# EAGLE design Felderblock6-a-2 (EAGLE 9.6.2)
AUTHOR: Balazs Racz; DRAWING_TITLE: Felderblock Mockup; LICENSE: Licensed by the Solderpad Hardware License V2.0; REVISION: A1; YEAR: 2024
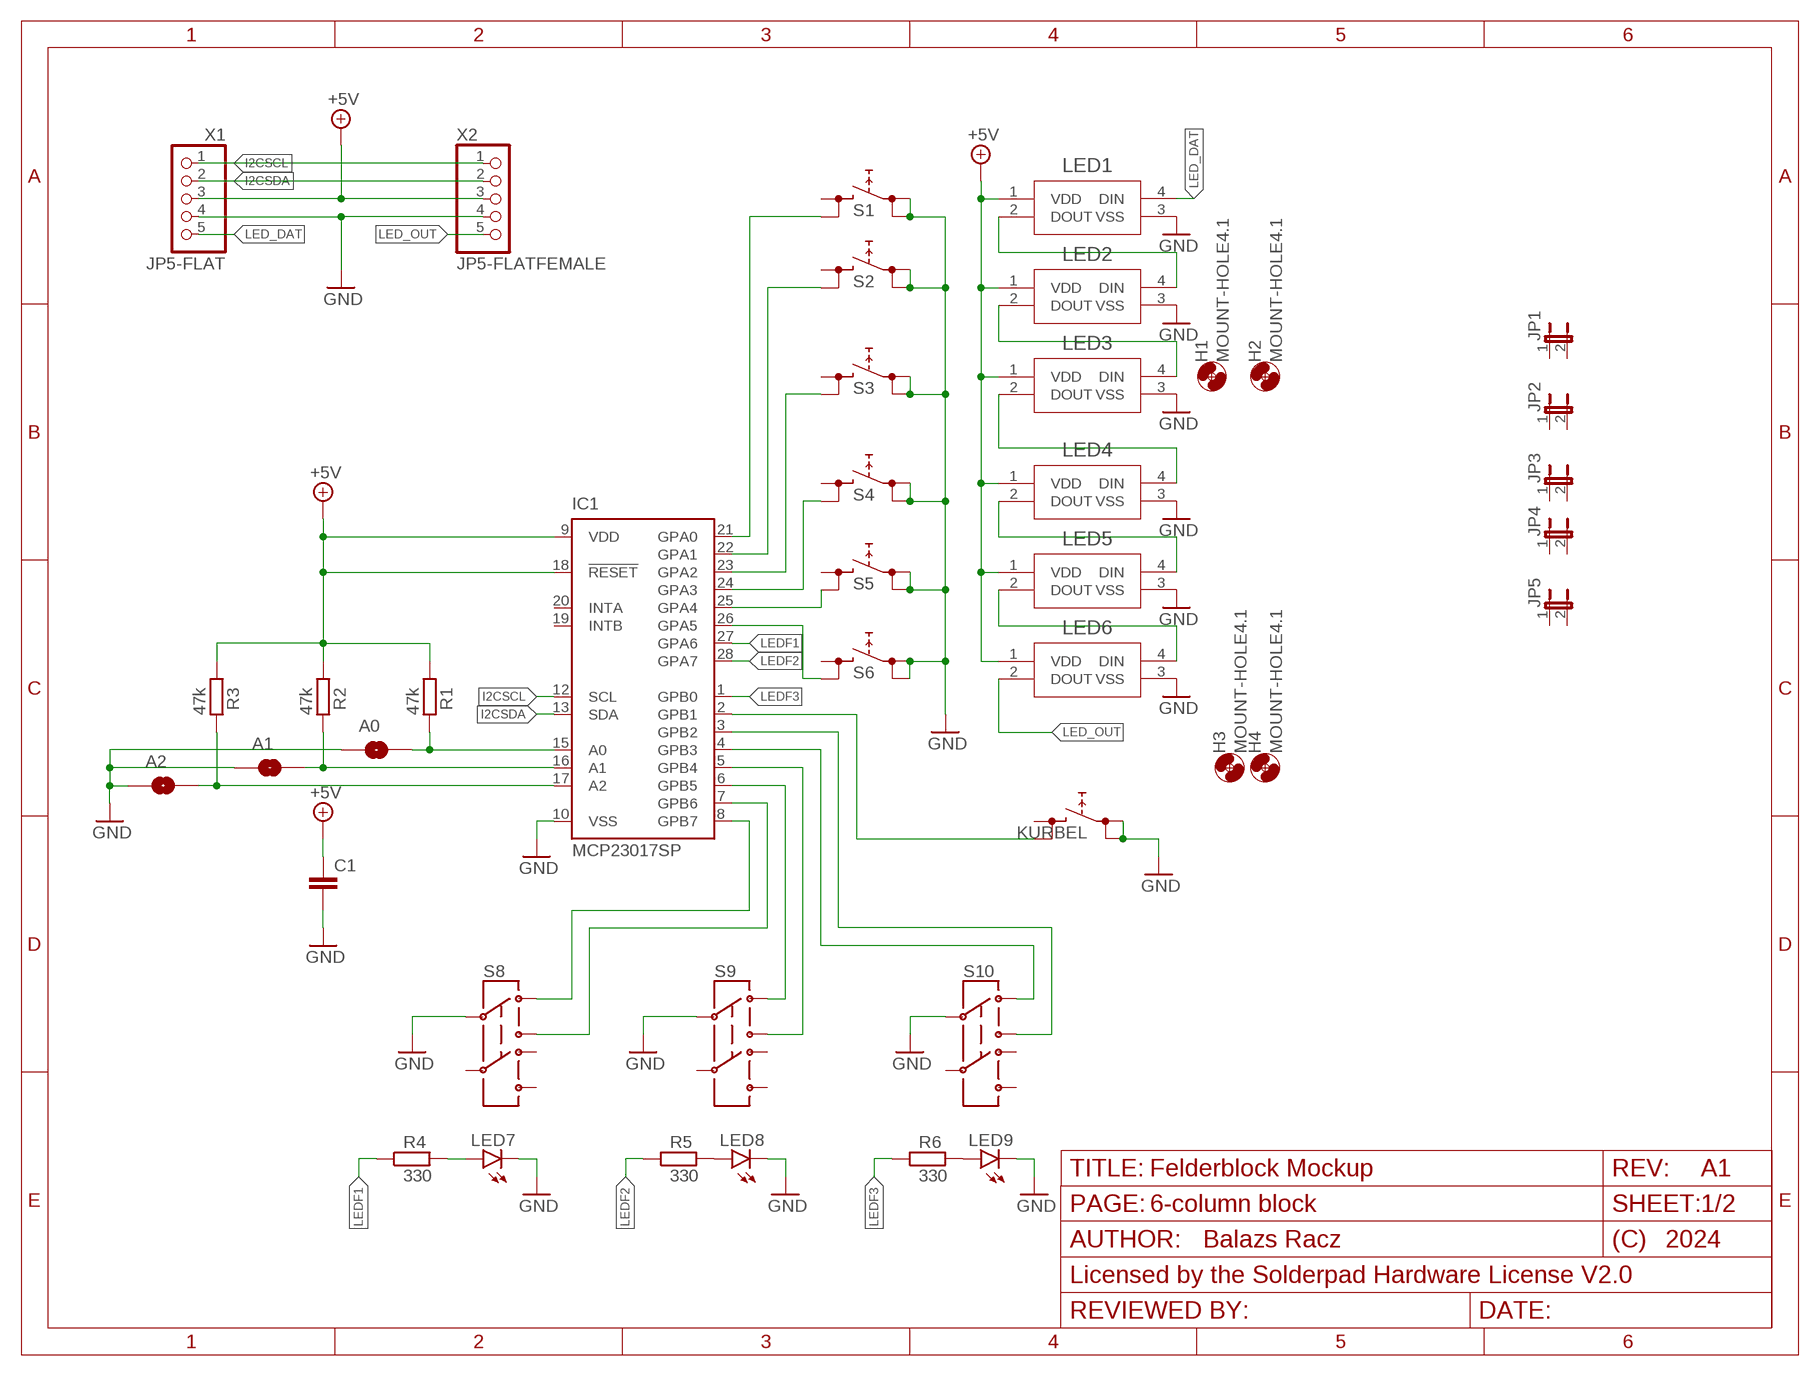
[diagram p0: schematic, sheet 1]
FRAME1 (FRAME_A_L): PAGE: 6-column block
FRAME2 (FRAME_A_L): PAGE: Input ports

## Parts
A0  SJRND2  [SJ_RND2]
A1  SJRND2  [SJ_RND2]
A2  SJRND2  [SJ_RND2]
C1  C-EUC0805  [C0805]
H1  MOUNT-HOLE4.1  [4,1]
H2  MOUNT-HOLE4.1  [4,1]
H3  MOUNT-HOLE4.1  [4,1]
H4  MOUNT-HOLE4.1  [4,1]
IC1  MCP23017SP  [DIL28-3]
JP1  FELD-BOARD-HOLDER  [FELD-BOARD-HOLDER]
JP2  FELD-BOARD-HOLDER  [FELD-BOARD-HOLDER]
JP3  FELD-BOARD-HOLDER  [FELD-BOARD-HOLDER]
JP4  FELD-BOARD-HOLDER  [FELD-BOARD-HOLDER]
JP5  FELD-BOARD-HOLDER  [FELD-BOARD-HOLDER]
KURBEL  W1  TACTSW-6X6S  [TACTSW-6X6]
LED1  LED-2812BCOM-16347_SPK-M  [COM-16347_SPK-M]
LED2  LED-2812BCOM-16347_SPK-M  [COM-16347_SPK-M]
LED3  LED-2812BCOM-16347_SPK-M  [COM-16347_SPK-M]
LED4  LED-2812BCOM-16347_SPK-M  [COM-16347_SPK-M]
LED5  LED-2812BCOM-16347_SPK-M  [COM-16347_SPK-M]
LED6  LED-2812BCOM-16347_SPK-M  [COM-16347_SPK-M]
LED7  LEDCHIPLED_0805  [CHIPLED_0805]
LED8  LEDCHIPLED_0805  [CHIPLED_0805]
LED9  LEDCHIPLED_0805  [CHIPLED_0805]
R1  47k  R-EU_R0805  [R0805]
R2  47k  R-EU_R0805  [R0805]
R3  47k  R-EU_R0805  [R0805]
R4  330  R-EU_R0805  [R0805]
R5  330  R-EU_R0805  [R0805]
R6  330  R-EU_R0805  [R0805]
S1  W1  TACTSW-6X6S  [TACTSW-6X6]
S2  W1  TACTSW-6X6S  [TACTSW-6X6]
S3  W1  TACTSW-6X6S  [TACTSW-6X6]
S4  W1  TACTSW-6X6S  [TACTSW-6X6]
S5  W1  TACTSW-6X6S  [TACTSW-6X6]
S6  W1  TACTSW-6X6S  [TACTSW-6X6]
S8  SWITCH-DPDT  [DP-T1]
S9  SWITCH-DPDT  [DP-T1]
S10  SWITCH-DPDT  [DP-T1]
X1  JP5-FLAT  [JP5F]
X2  JP5-FLATFEMALE  [JP5F-FEM]

## Nets
+5V [pwr]: C1.1 IC1.9(VDD) IC1.18(!RESET) LED1.1(VDD) LED2.1(VDD) LED3.1(VDD) LED4.1(VDD) LED5.1(VDD) LED6.1(VDD) R1.1 R2.1 R3.1 X1.3 X2.3
GND: A0.P$1 A1.P$1 A2.P$1 C1.2 IC1.10(VSS) KURBEL.1(1.1) KURBEL.2(1.2) LED1.3(VSS) LED2.3(VSS) LED3.3(VSS) LED4.3(VSS) LED5.3(VSS) LED6.3(VSS) LED7.C LED8.C LED9.C S1.1(1.1) S1.2(1.2) S2.1(1.1) S2.2(1.2) S3.1(1.1) S3.2(1.2) S4.1(1.1) S4.2(1.2) S5.1(1.1) S5.2(1.2) S6.1(1.1) S6.2(1.2) S8.2(1C) S9.2(1C) S10.2(1C) X1.4 X2.4
I2CSCL: IC1.12(SCL) X1.1 X2.1
I2CSDA: IC1.13(SDA) X1.2 X2.2
LED_DAT: LED1.4(DIN) X1.5
LED_OUT: LED6.2(DOUT) X2.5
LEDF1: IC1.27(GPA6) R4.1
LEDF2: IC1.28(GPA7) R5.1
LEDF3: IC1.1(GPB0) R6.1
N$1: A0.P$2 IC1.15(A0) R1.2
N$2: A1.P$2 IC1.16(A1) R2.2
N$3: A2.P$2 IC1.17(A2) R3.2
N$4: IC1.21(GPA0) S1.4(2.2)
N$5: IC1.22(GPA1) S2.4(2.2)
N$6: IC1.23(GPA2) S3.4(2.2)
N$7: IC1.24(GPA3) S4.4(2.2)
N$8: IC1.25(GPA4) S5.4(2.2)
N$9: IC1.26(GPA5) S6.4(2.2)
N$10: IC1.8(GPB7) S8.1(1A)
N$11: IC1.7(GPB6) S8.3(1B)
N$12: LED1.2(DOUT) LED2.4(DIN)
N$13: LED2.2(DOUT) LED3.4(DIN)
N$14: LED3.2(DOUT) LED4.4(DIN)
N$15: LED4.2(DOUT) LED5.4(DIN)
N$16: LED5.2(DOUT) LED6.4(DIN)
N$17: IC1.6(GPB5) S9.1(1A)
N$18: IC1.5(GPB4) S9.3(1B)
N$19: IC1.4(GPB3) S10.1(1A)
N$20: IC1.3(GPB2) S10.3(1B)
N$21: LED8.A R5.2
N$22: LED7.A R4.2
N$23: LED9.A R6.2
N$24: IC1.2(GPB1) KURBEL.4(2.2)
Unconnected: IC1.19(INTB) IC1.20(INTA) JP1.1 JP1.2 JP2.1 JP2.2 JP3.1 JP3.2 JP4.1 JP4.2 JP5.1 JP5.2 KURBEL.3(2.1) S1.3(2.1) S2.3(2.1) S3.3(2.1) S4.3(2.1) S5.3(2.1) S6.3(2.1) S8.4(2A) S8.5(2C) S8.6(2B) S9.4(2A) S9.5(2C) S9.6(2B) S10.4(2A) S10.5(2C) S10.6(2B)

## Library data of the parts
A0 A1 A2 = eagleparts:SJ: SMD solder JUMPER
C1 = rcl:C-EU: CAPACITOR, European symbol; SPICEPREFIX: C
H1-H4 = holes:MOUNT-HOLE: MOUNTING HOLE with drill center marker
IC1 = microchip:MCP23017: http://ww1.microchip.com/downloads/en/DeviceDoc/21952a.pdf Source: http://ww1.microchip.com/downloads/en/DeviceDoc/21952a.pdf; MF: MICROCHIP; MPN: MCP23017-E/SP; OC_FARNELL: 1332088; OC_NEWARK: 31K2959
JP1-JP5 = eagleparts:FELD-BOARD-HOLDER: JUMPER
KURBEL S1-S6 = g-e2e-training:TACTSW-6X6: 6.2 X 6.5mm TACT Switch (SMD) Source: http://www3.alps.co.jp/WebObjects/catalog.woa/PDF/E/Switch/Tact/SKHM/SKHM.PDF
LED1-LED6 = eagleparts:LED-2812B; COPYRIGHT: Copyright (C) 2024 Ultra Librarian. All rights reserved.; MANUFACTURER_PART_NUMBER: COM-16347; MFR_NAME: Sparkfun; TYPE: LED Addressable
LED7-LED9 = led:LED: LED OSRAM: - CHIPLED LG R971, LG N971, LY N971, LG Q971, LY Q971, LO R971, LY R971 LH N974, LH R974 LS Q976, LO Q976, LY Q976 LO Q996 - Hyper CHIPLED LW Q18S LB Q993, LB Q99A, LB R99A - SideLED LS A670, LO A670, LY A670, LG A670, LP A670 LB A673, LV A673, LT A673, LW A673 LH A674 LY A675 LS A676, LA A676, LO A676, LY A676, LW A676 LS A679, LY A679, LG A679 - Hyper Micro SIDELED® LS Y876, LA Y876, LO Y876, LY Y876 LT Y87S - SmartLED LW L88C, LW L88S LB L89C, LB L89S, LG L890 LS L89K, LO L89K, LY L89K LS L896, LA L896, LO L896, LY L896 - TOPLED LS T670, LO T670, LY T670, LG T670, LP T670 LSG T670, LSP T670, LSY T670, LOP T670, LYG T670 LG T671, LOG T671, LSG T671 LB T673, LV T673, LT T673, LW T673 LH T674 LS T676, LA T676, LO T676, LY T676, LB T676, LH T676, LSB T676, LW T676 LB T67C, LV T67C, LT T67C, LS T67K, LO T67K, LY T67K, LW E67C LS E67B, LA E67B, LO E67B, LY E67B, LB E67C, LV E67C, LT E67C LW T67C LS T679, LY T679, LG T679 LS T770, LO T770, LY T770, LG T770, LP T770 LB T773, LV T773, LT T773, LW T773 LH T774 LS E675, LA E675, LY E675, LS T675 LS T776, LA T776, LO T776, LY T776, LB T776 LHGB T686 LT T68C, LB T68C - Hyper Mini TOPLED® LB M676 - Mini TOPLED Santana® LG M470 LS M47K, LO M47K, LY M47K Source: http://www.osram.convergy.de LUXEON: - LUMILED® LXK2-PW12-R00, LXK2-PW12-S00, LXK2-PW14-U00, LXK2-PW14-V00 LXK2-PM12-R00, LXK2-PM12-S00, LXK2-PM14-U00 LXK2-PE12-Q00, LXK2-PE12-R00, LXK2-PE12-S00, LXK2-PE14-T00, LXK2-PE14-U00 LXK2-PB12-K00, LXK2-PB12-L00, LXK2-PB12-M00, LXK2-PB14-N00, LXK2-PB14-P00, LXK2-PB14-Q00 LXK2-PR12-L00, LXK2-PR12-M00, LXK2-PR14-Q00, LXK2-PR14-R00 LXK2-PD12-Q00, LXK2-PD12-R00, LXK2-PD12-S00 LXK2-PH12-R00, LXK2-PH12-S00 LXK2-PL12-P00, LXK2-PL12-Q00, LXK2-PL12-R00 Source: www.luxeon.com KINGBRIGHT: KA-3528ASYC Source: www.kingbright.com
R1-R6 = rcl:R-EU_: RESISTOR, European symbol; SPICEPREFIX: R
S8-S10 = eagleparts:SWITCH-DPDT: DPDT Version of the COM-00597
X1 X2 = eagleparts:JP5-FLAT

## Net classes
0 default: width 0.254 mm, clearance 0.254 mm
1 pwr: width 0.406 mm, clearance 0.254 mm

## Board
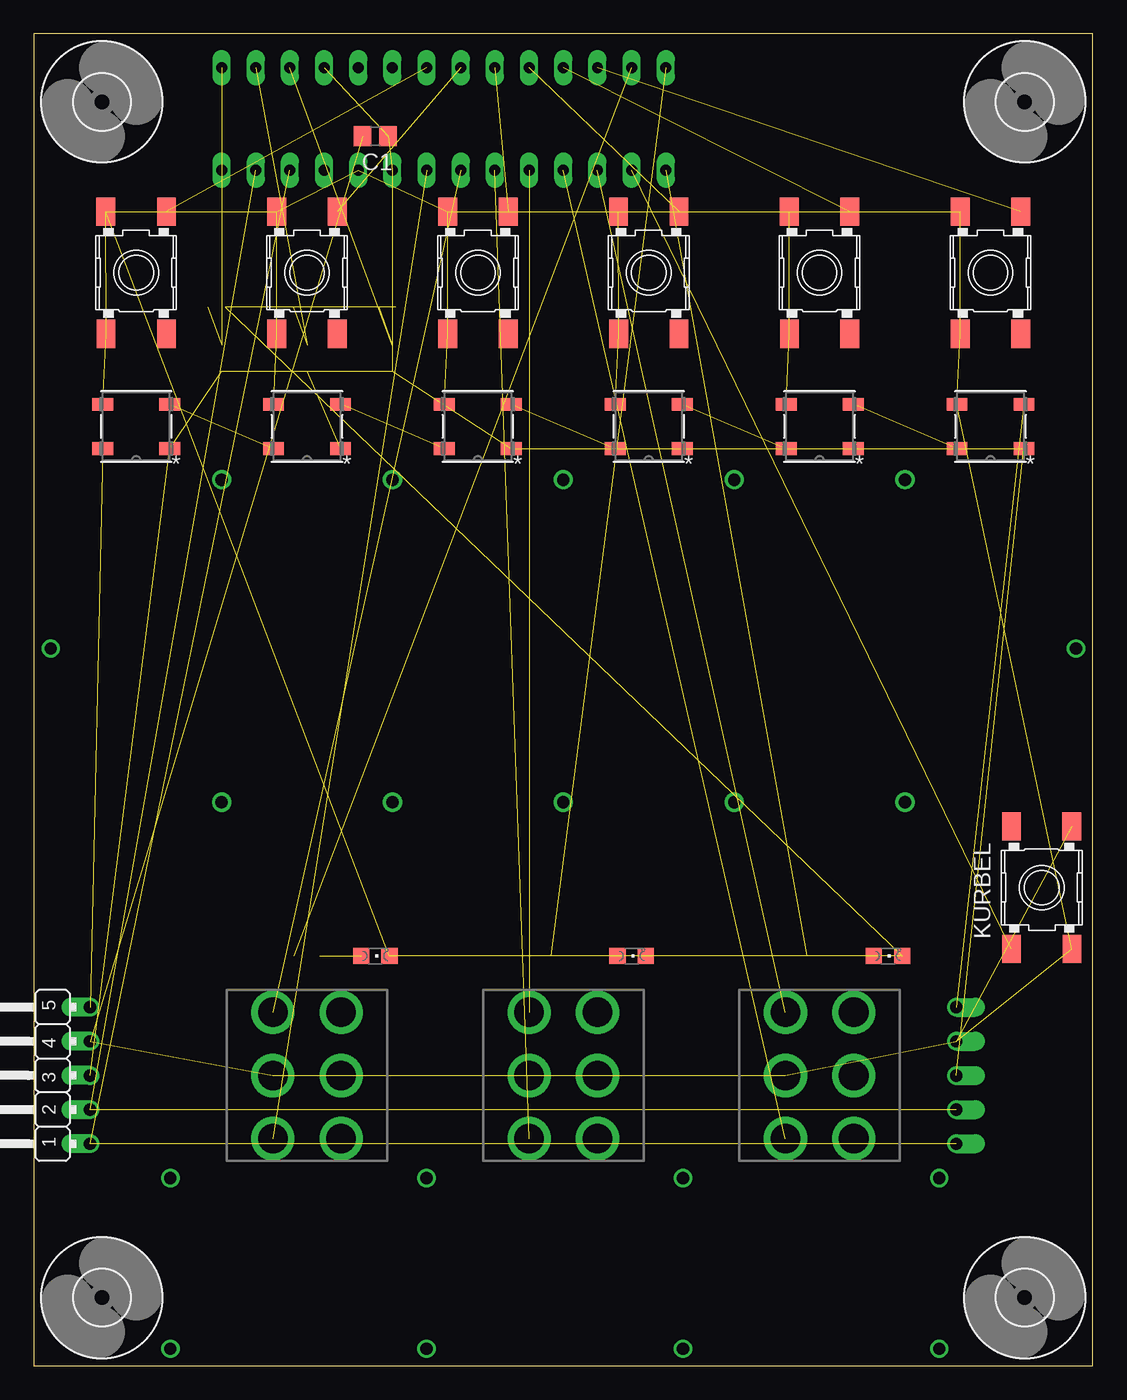
[diagram p1: board, top side]
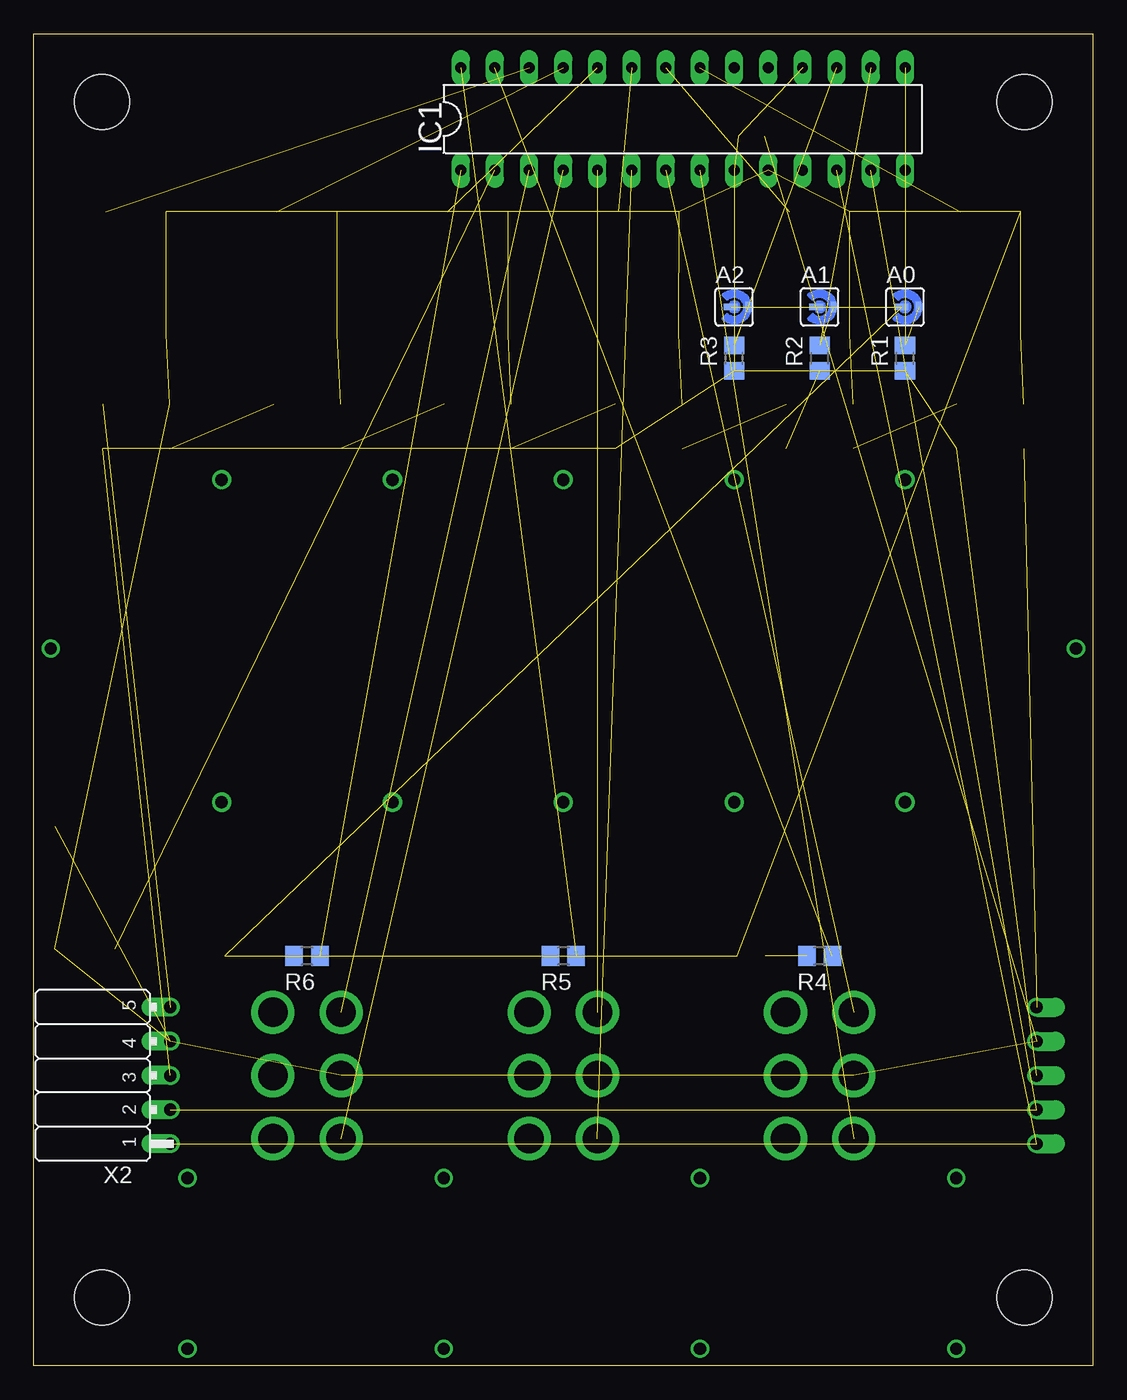
[diagram p2: board, bottom side, seen from below]

Size 78.74 x 99.06 mm. Coordinates in mm from the lower left corner, seen from the top.
Outline: 0,0 78.74,0 78.74,99.06 0,99.06 0,0
Copper layers (1*16): Top 0.035mm / dielectric 1.5mm / Bottom 0.035mm
Design rules "SeeedStudio_2layer_DRU_no_angle_20140221": minimum track width 6mil, minimum drill 12mil, track to track 6mil, track to pad 6mil, pad to pad 6mil, via to via 6mil, smd to smd 0mil, copper to edge 10mil, drill to drill 10mil, minimum pad ring 10mil, minimum via ring 6mil, stop-mask expansion 2mil, vias tented up to drill 100mil, thermal gap 10mil

### Footprints (pad centres in the part's own frame; a part is rotated, then mirrored left to right if it is on the bottom)
SJ_RND2 = smd 1.016 x 0.508: P$1 -0.254,0 | smd 0.406 x 0.813: P$2 1.016,0
C0805 = smd 1.3 x 1.5: 1 -0.95,0; 2 0.95,0
4,1 = hole 4.1: 0,0
DIL28-3 = drill 0.813 long: 1 -16.51,-3.81; 2 -13.97,-3.81; 3 -11.43,-3.81; 4 -8.89,-3.81; 5 -6.35,-3.81; 6 -3.81,-3.81; 7 -1.27,-3.81; 8 1.27,-3.81; 9 3.81,-3.81; 10 6.35,-3.81; 11 8.89,-3.81; 12 11.43,-3.81; 13 13.97,-3.81; 14 16.51,-3.81; 15 16.51,3.81; 16 13.97,3.81; 17 11.43,3.81; 18 8.89,3.81; 19 6.35,3.81; 20 3.81,3.81; 21 1.27,3.81; 22 -1.27,3.81; 23 -3.81,3.81; 24 -6.35,3.81; 25 -8.89,3.81; 26 -11.43,3.81; 27 -13.97,3.81; 28 -16.51,3.81
FELD-BOARD-HOLDER = drill 0.914: 1 0,0; 2 0,23.978
TACTSW-6X6 = smd 2.1 x 1.4: 1 -4.55,2.24; 2 4.55,2.25; 3 -4.55,-2.25; 4 4.55,-2.25
COM-16347_SPK-M = smd 1.549 x 0.94: 1 -2.489,1.65; 2 -2.489,-1.65; 3 2.489,-1.65; 4 2.489,1.65
CHIPLED_0805 = smd 1.2 x 1.2: A 0,-1.05; C 0,1.05
R0805 = smd 1.3 x 1.5: 1 -0.95,0; 2 0.95,0
DP-T1 = drill 2.2 pad 3.2: 1 -4.699,2.54; 2 0,2.54; 3 4.699,2.54; 4 -4.699,-2.54; 5 0,-2.54; 6 4.699,-2.54
JP5F = drill 0.914 offset: 1 -5.08,0; 2 -2.54,0; 3 0,0; 4 2.54,0; 5 5.08,0
JP5F-FEM = drill 0.914 offset: 1 -5.08,0; 2 -2.54,0; 3 0,0; 4 2.54,0; 5 5.08,0

### Placement (x,y rotation side)
A0  13.97,78.74 0 bottom
A1  20.32,78.74 0 bottom
A2  26.67,78.74 0 bottom
C1  25.4,91.44 180 top
H1  73.66,5.08 0 top
H2  5.08,5.08 0 top
H3  73.66,93.98 0 top
H4  5.08,93.98 0 top
IC1  30.48,92.71 0 bottom
JP1  13.97,41.91 0 top
JP2  26.67,41.91 0 top
JP3  64.77,41.91 0 top
JP4  52.07,41.91 0 top
JP5  39.37,41.91 0 top
KURBEL  74.93,35.56 270 top
LED1  7.62,69.85 180 top
LED2  20.32,69.85 180 top
LED3  33.02,69.85 180 top
LED4  45.72,69.85 180 top
LED5  58.42,69.85 180 top
LED6  71.12,69.85 180 top
LED7  25.4,30.48 270 top
LED8  44.45,30.48 270 top
LED9  63.5,30.48 270 top
R1  13.97,74.93 90 bottom
R2  20.32,74.93 90 bottom
R3  26.67,74.93 90 bottom
R4  20.32,30.48 180 bottom
R5  39.37,30.48 180 bottom
R6  58.42,30.48 180 bottom
S1  7.62,81.28 90 top
S2  20.32,81.28 90 top
S3  33.02,81.28 90 top
S4  45.72,81.28 90 top
S5  58.42,81.28 90 top
S6  71.12,81.28 90 top
S8  20.32,21.59 90 top
S9  39.37,21.59 90 top
S10  58.42,21.59 90 top
X1  4.19,21.59 90 top
X2  68.58,21.59 90 bottom

### Tracks (layer width: path | path; a pad name or v marks a point on that pad's centre or on a via)
+5V  (13 unrouted)
GND  (32 unrouted)
I2CSCL  (2 unrouted)
I2CSDA  (2 unrouted)
LED_DAT  (1 unrouted)
LED_OUT  (1 unrouted)
LEDF1  (1 unrouted)
LEDF2  (1 unrouted)
LEDF3  (1 unrouted)
N$1  (2 unrouted)
N$2  (2 unrouted)
N$3  (2 unrouted)
N$4  (1 unrouted)
N$5  (1 unrouted)
N$6  (1 unrouted)
N$7  (1 unrouted)
N$8  (1 unrouted)
N$9  (1 unrouted)
N$10  (1 unrouted)
N$11  (1 unrouted)
N$12  (1 unrouted)
N$13  (1 unrouted)
N$14  (1 unrouted)
N$15  (1 unrouted)
N$16  (1 unrouted)
N$17  (1 unrouted)
N$18  (1 unrouted)
N$19  (1 unrouted)
N$20  (1 unrouted)
N$21  (1 unrouted)
N$22  (1 unrouted)
N$23  (1 unrouted)
N$24  (1 unrouted)
N$25  (via drill 0.91)
  other vias: 77.47,53.34
N$26  (via drill 0.91)
  other vias: 1.27,53.34
N$27  (via drill 0.91)
  other vias: 29.21,13.97
N$28  (via drill 0.91)
  other vias: 48.26,13.97
N$29  (via drill 0.91)
  other vias: 67.31,13.97
N$30  (via drill 0.91)
  other vias: 10.16,13.97
N$31  (via drill 0.91)
  other vias: 10.16,1.27
N$32  (via drill 0.91)
  other vias: 29.21,1.27
N$33  (via drill 0.91)
  other vias: 48.26,1.27
N$34  (via drill 0.91)
  other vias: 67.31,1.27